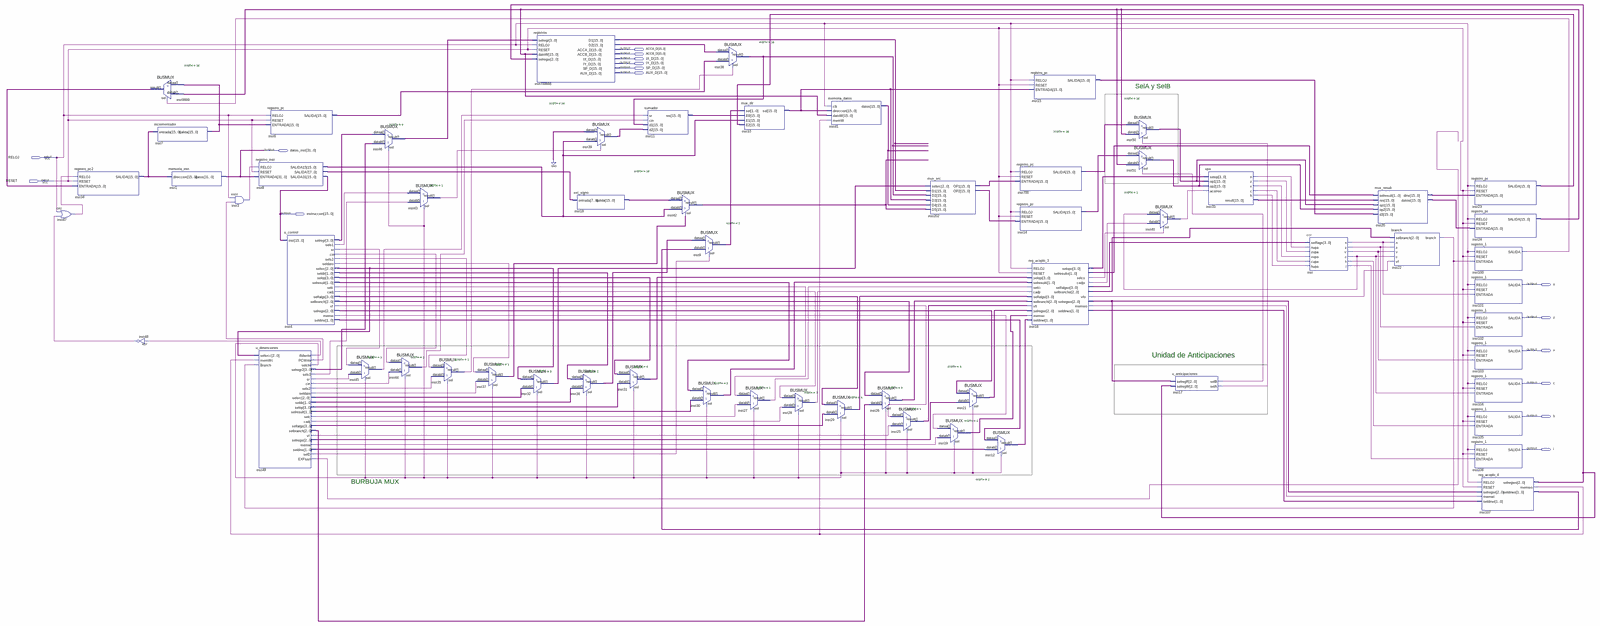
[diagram p0: schematic sheet, whole]
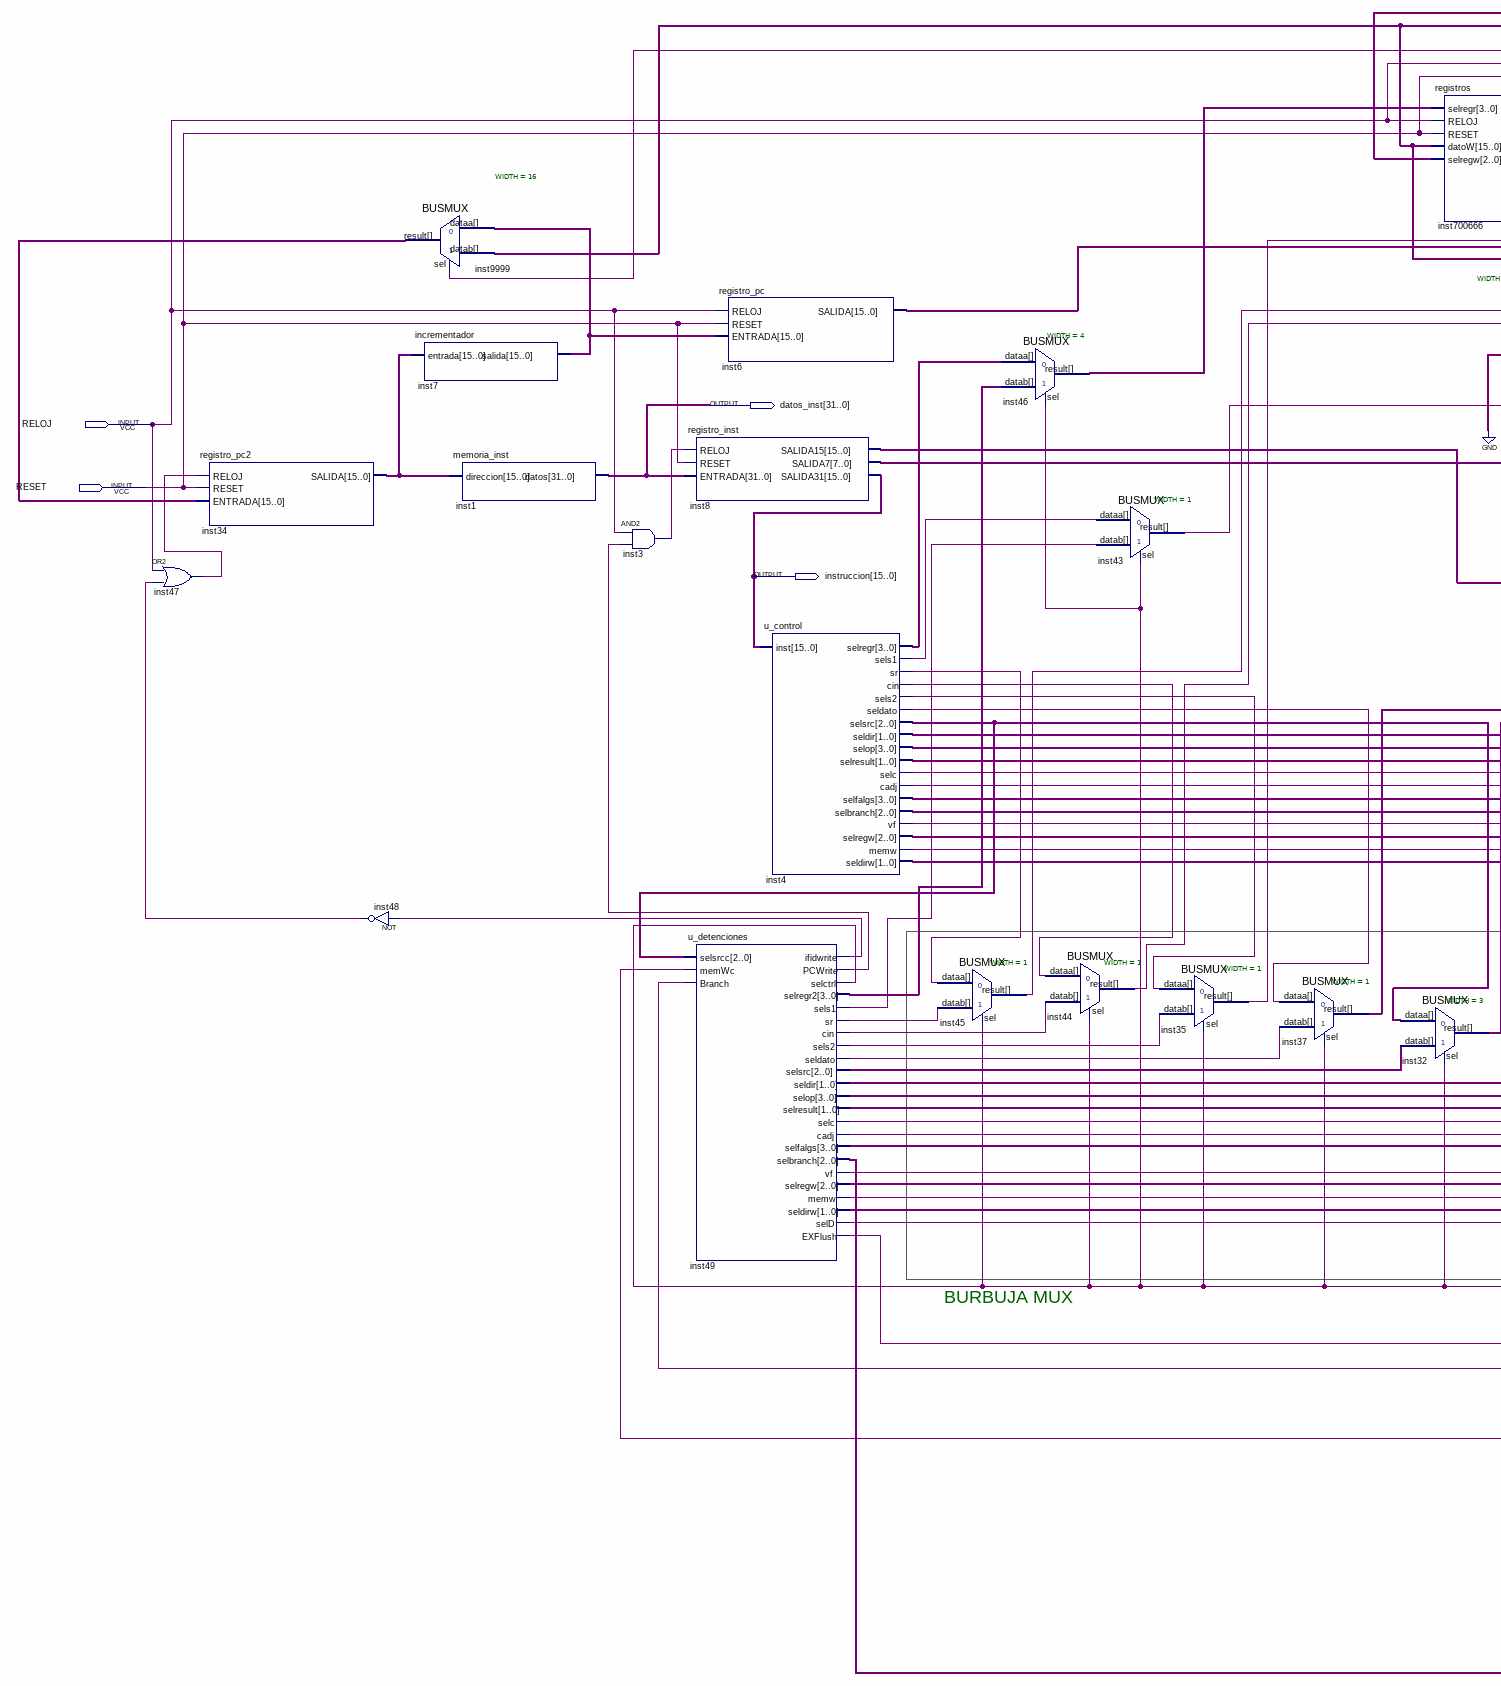
[diagram p1: schematic sheet, left part]
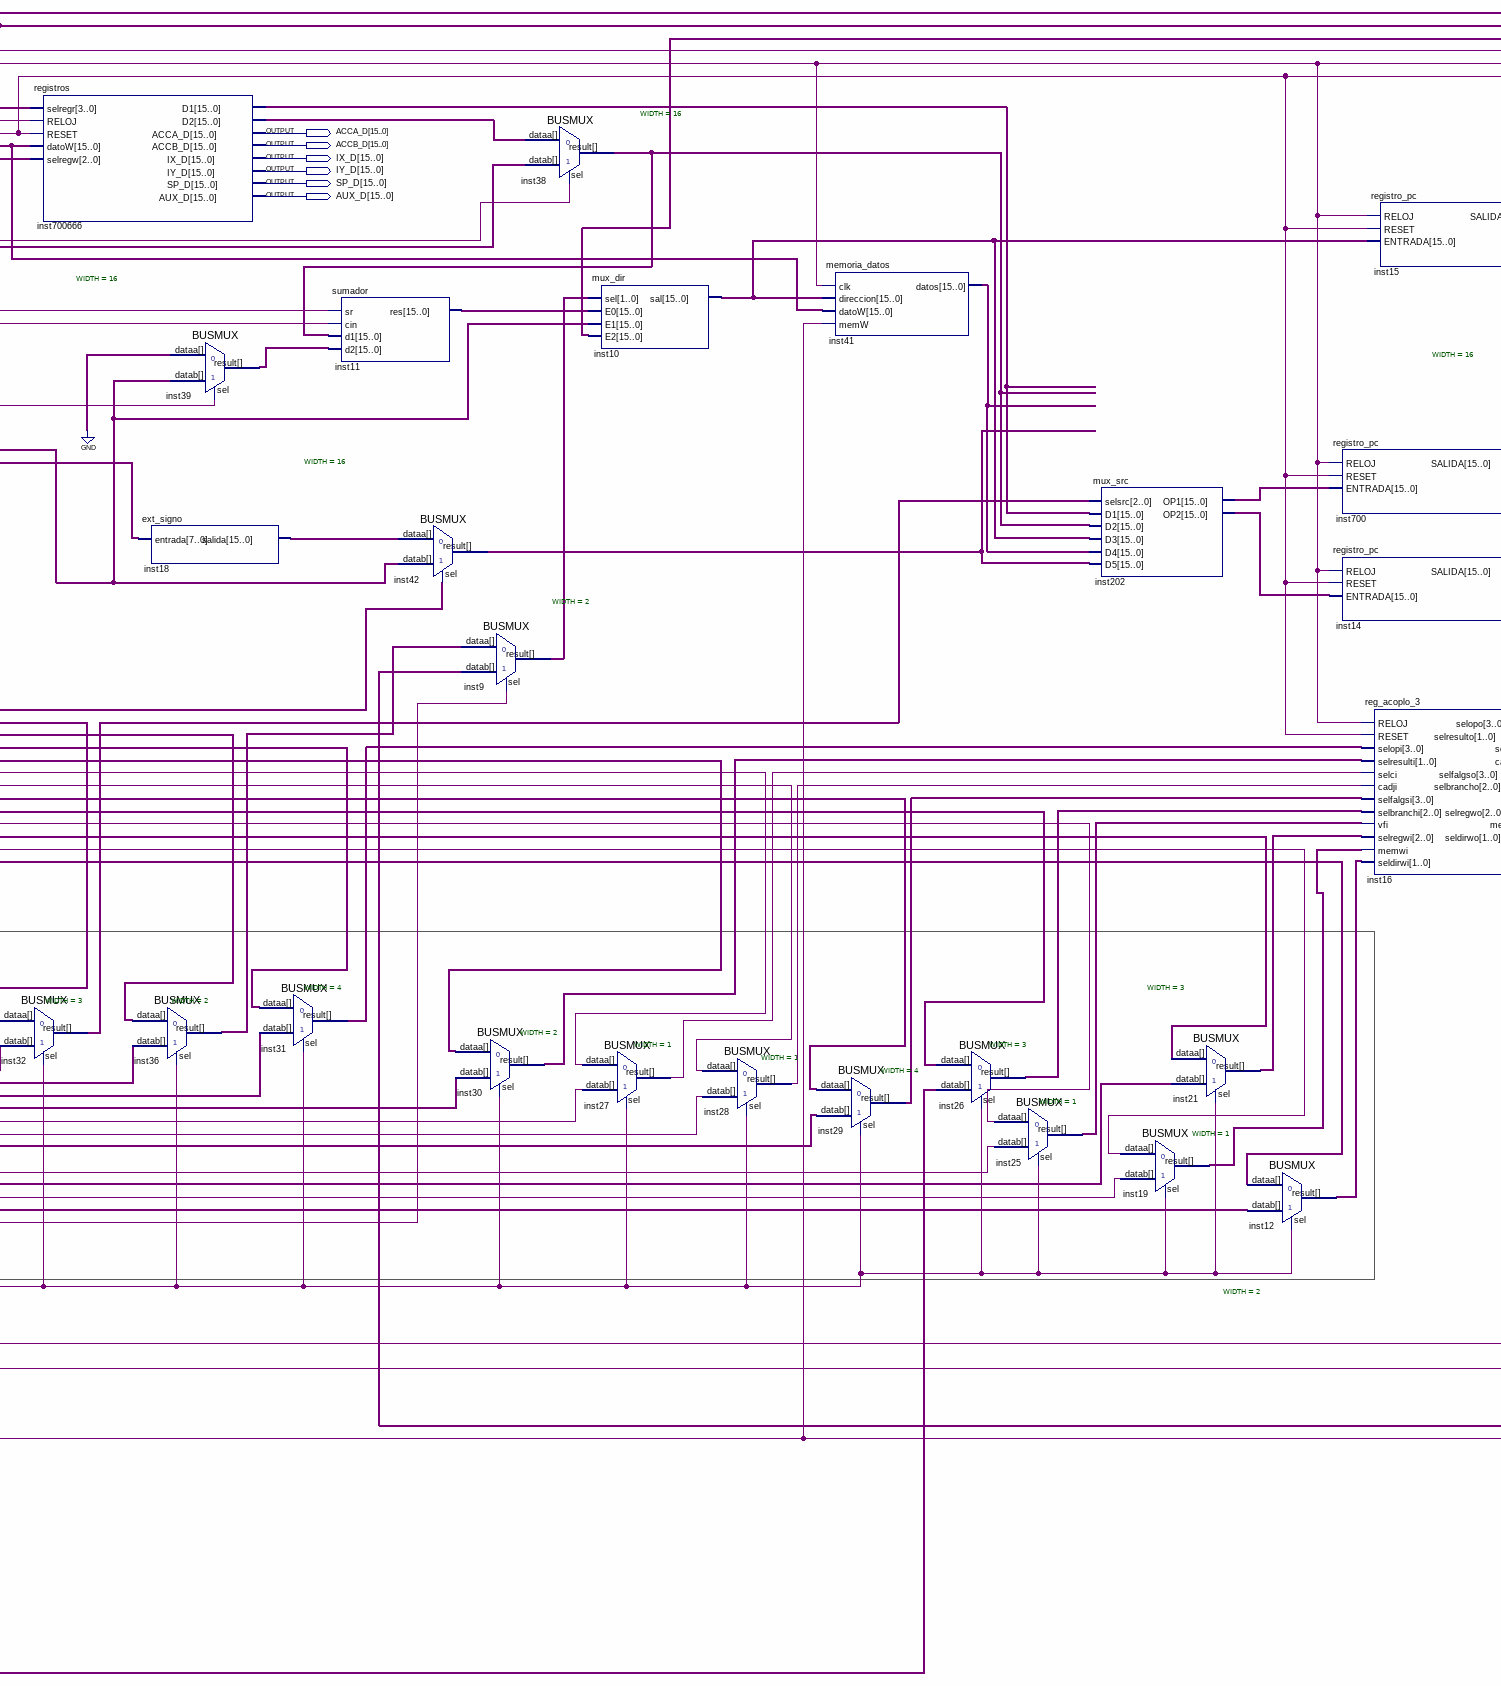
[diagram p2: schematic sheet, centre part]
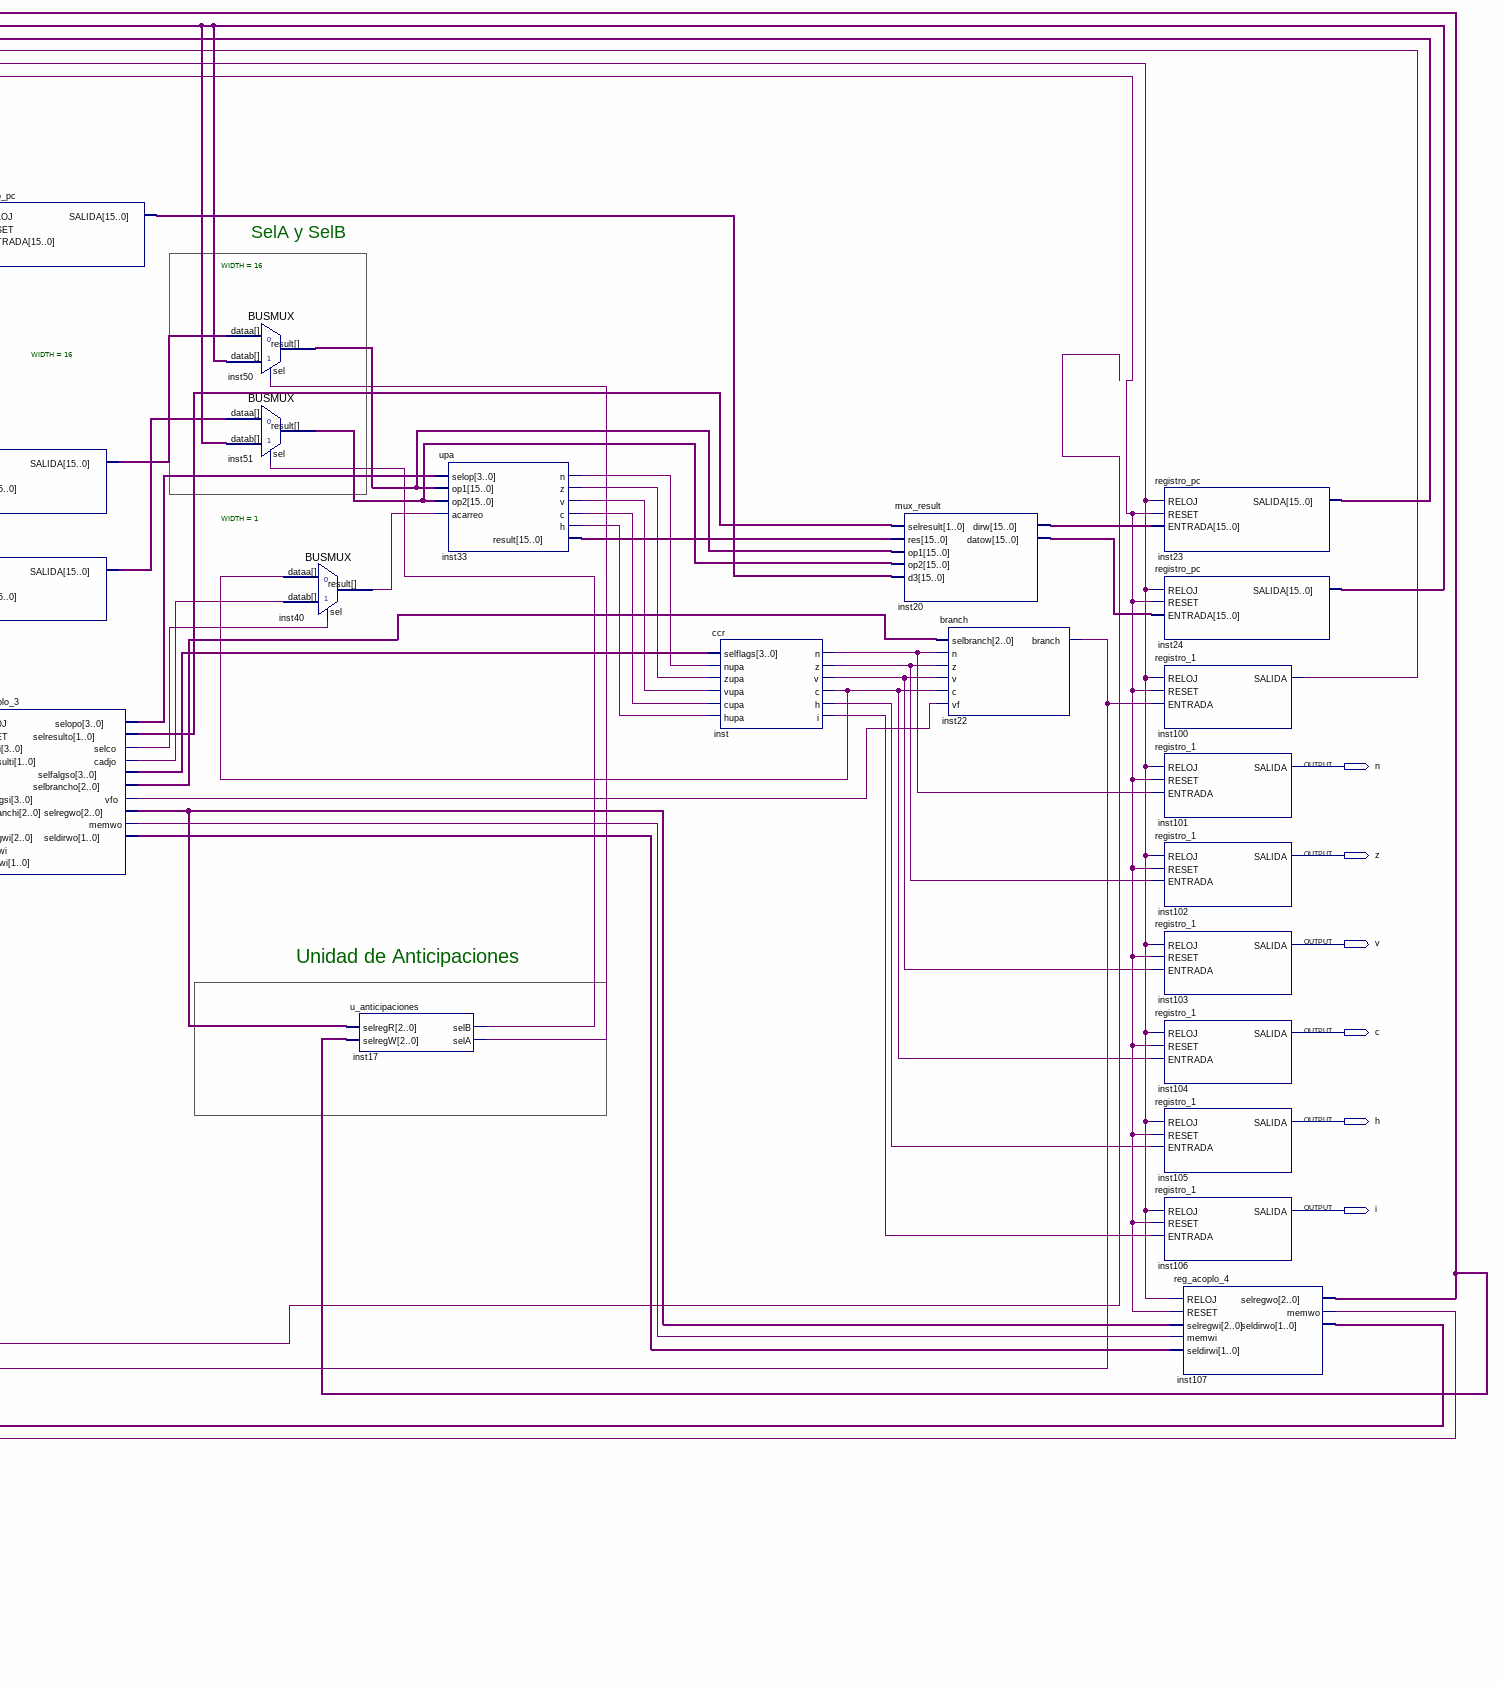
[diagram p3: schematic sheet, right part]
// Quartus schematic pipeline.bdf as structural Verilog: 61 symbols, 16 pins
module pipeline (
  input  RELOJ,
  input  RESET,
  output [15:0] ACCA_D,
  output [15:0] ACCB_D,
  output [15:0] IX_D,
  output [15:0] IY_D,
  output [15:0] SP_D,
  output [15:0] AUX_D,
  output [31:0] datos_inst,
  output [15:0] instruccion,
  output n,
  output z,
  output v,
  output c,
  output h,
  output i
);

  wire inst3_out, inst4_cadj, inst4_cin, inst4_memw, inst4_selc, inst4_seldato, inst4_sels1, inst4_sels2,
       inst4_sr, inst4_vf, inst16_cadjo, inst16_memwo, inst16_selco, inst16_vfo, inst17_sela, inst17_selb,
       inst19_result, inst22_branch, inst25_result, inst27_result, inst28_result, inst33_c, inst33_h,
       inst33_n, inst33_v, inst33_z, inst35_result, inst37_result, inst40_result, inst43_result,
       inst44_result, inst45_result, inst47_out, inst48_out, inst49_cadj, inst49_cin, inst49_exflush,
       inst49_ifidwrite, inst49_memw, inst49_pcwrite, inst49_selc, inst49_selctrl, inst49_seld,
       inst49_seldato, inst49_sels1, inst49_sels2, inst49_sr, inst49_vf, inst100_salida, inst107_memwo,
       inst_c, inst_h, inst_i, inst_n, inst_v, inst_z;
  wire [1:0] inst4_seldir, inst4_seldirw, inst4_selresult, inst9_result, inst12_result, inst16_seldirwo,
       inst16_selresulto, inst30_result, inst36_result, inst49_seldir, inst49_seldirw, inst49_selresult,
       inst107_seldirwo;
  wire [2:0] inst4_selbranch, inst4_selregw, inst4_selsrc, inst16_selbrancho, inst16_selregwo, inst21_result,
       inst26_result, inst32_result, inst49_selbranch, inst49_selregw, inst49_selsrc, inst107_selregwo;
  wire [3:0] inst4_selfalgs, inst4_selop, inst4_selregr, inst16_selfalgso, inst16_selopo, inst29_result,
       inst31_result, inst46_result, inst49_selfalgs, inst49_selop, inst49_selregr2;
  wire [7:0] inst8_salida7;
  wire [15:0] inst6_salida, inst7_salida, inst8_salida15, inst10_sal, inst11_res, inst14_salida,
       inst15_salida, inst18_salida, inst20_datow, inst20_dirw, inst23_salida, inst24_salida, inst33_result,
       inst34_salida, inst38_result, inst39_result, inst41_datos, inst42_result, inst50_result,
       inst51_result, inst202_op1, inst202_op2, inst700_salida, inst9999_result, inst700666_d1, inst700666_d2;

  registro_pc2 inst34 (.RELOJ(inst47_out), .RESET(RESET), .ENTRADA(inst9999_result), .SALIDA(inst34_salida));
  or inst47 (inst47_out, RELOJ, inst48_out);
  not inst48 (inst48_out, inst49_ifidwrite);
  BUSMUX #(.WIDTH(16)) inst9999 (
    .datab(inst24_salida), .sel(inst100_salida), .dataa(inst7_salida), .result(inst9999_result));
  incrementador inst7 (.entrada(inst34_salida), .salida(inst7_salida));
  memoria_inst inst1 (.direccion(inst34_salida), .datos(datos_inst));
  and inst3 (inst3_out, RELOJ, inst49_pcwrite);
  registro_inst inst8 (
    .RELOJ(inst3_out), .RESET(RESET), .ENTRADA(datos_inst), .SALIDA15(inst8_salida15),
    .SALIDA7(inst8_salida7), .SALIDA31(instruccion));
  u_detenciones inst49 (
    .selsrcc(inst4_selsrc), .memWc(inst107_memwo), .Branch(inst22_branch), .ifidwrite(inst49_ifidwrite),
    .PCWrite(inst49_pcwrite), .selctrl(inst49_selctrl), .selregr2(inst49_selregr2), .sels1(inst49_sels1),
    .sr(inst49_sr), .cin(inst49_cin), .sels2(inst49_sels2), .seldato(inst49_seldato), .selsrc(inst49_selsrc),
    .seldir(inst49_seldir), .selop(inst49_selop), .selresult(inst49_selresult), .selc(inst49_selc),
    .cadj(inst49_cadj), .selfalgs(inst49_selfalgs), .selbranch(inst49_selbranch), .vf(inst49_vf),
    .selregw(inst49_selregw), .memw(inst49_memw), .seldirw(inst49_seldirw), .selD(inst49_seld),
    .EXFlush(inst49_exflush));
  registro_pc inst6 (.RELOJ(RELOJ), .RESET(RESET), .ENTRADA(inst7_salida), .SALIDA(inst6_salida));
  u_control inst4 (
    .inst(instruccion), .selregr(inst4_selregr), .sels1(inst4_sels1), .sr(inst4_sr), .cin(inst4_cin),
    .sels2(inst4_sels2), .seldato(inst4_seldato), .selsrc(inst4_selsrc), .seldir(inst4_seldir),
    .selop(inst4_selop), .selresult(inst4_selresult), .selc(inst4_selc), .cadj(inst4_cadj),
    .selfalgs(inst4_selfalgs), .selbranch(inst4_selbranch), .vf(inst4_vf), .selregw(inst4_selregw),
    .memw(inst4_memw), .seldirw(inst4_seldirw));
  BUSMUX #(.WIDTH(1)) inst45 (.datab(inst49_sr), .sel(inst49_selctrl), .dataa(inst4_sr), .result(inst45_result));
  BUSMUX #(.WIDTH(4)) inst46 (
    .datab(inst49_selregr2), .sel(inst49_selctrl), .dataa(inst4_selregr), .result(inst46_result));
  BUSMUX #(.WIDTH(1)) inst44 (.datab(inst49_cin), .sel(inst49_selctrl), .dataa(inst4_cin), .result(inst44_result));
  BUSMUX #(.WIDTH(1)) inst43 (.datab(inst49_sels1), .sel(inst49_selctrl), .dataa(inst4_sels1), .result(inst43_result));
  BUSMUX #(.WIDTH(1)) inst35 (.datab(inst49_sels2), .sel(inst49_selctrl), .dataa(inst4_sels2), .result(inst35_result));
  BUSMUX #(.WIDTH(1)) inst37 (
    .datab(inst49_seldato), .sel(inst49_selctrl), .dataa(inst4_seldato), .result(inst37_result));
  BUSMUX #(.WIDTH(3)) inst32 (
    .datab(inst49_selsrc), .sel(inst49_selctrl), .dataa(inst4_selsrc), .result(inst32_result));
  registros inst700666 (
    .selregr(inst46_result), .RELOJ(RELOJ), .RESET(RESET), .datoW(inst24_salida), .selregw(inst107_selregwo),
    .D1(inst700666_d1), .D2(inst700666_d2), .ACCA_D(ACCA_D), .ACCB_D(ACCB_D), .IX_D(IX_D), .IY_D(IY_D),
    .SP_D(SP_D), .AUX_D(AUX_D));
  ext_signo inst18 (.entrada(inst8_salida7), .salida(inst18_salida));
  BUSMUX #(.WIDTH(2)) inst36 (
    .datab(inst49_seldir), .sel(inst49_selctrl), .dataa(inst4_seldir), .result(inst36_result));
  BUSMUX #(.WIDTH(16)) inst39 (.datab(inst8_salida15), .sel(inst43_result), .dataa({16{1'b0}}), .result(inst39_result));
  BUSMUX #(.WIDTH(4)) inst31 (.datab(inst49_selop), .sel(inst49_selctrl), .dataa(inst4_selop), .result(inst31_result));
  sumador inst11 (.sr(inst45_result), .cin(inst44_result), .d1(inst38_result), .d2(inst39_result), .res(inst11_res));
  BUSMUX #(.WIDTH(16)) inst42 (
    .datab(inst8_salida15), .sel(inst37_result), .dataa(inst18_salida), .result(inst42_result));
  BUSMUX #(.WIDTH(2)) inst9 (.datab(inst107_seldirwo), .sel(inst49_seld), .dataa(inst36_result), .result(inst9_result));
  BUSMUX #(.WIDTH(2)) inst30 (
    .datab(inst49_selresult), .sel(inst49_selctrl), .dataa(inst4_selresult), .result(inst30_result));
  BUSMUX #(.WIDTH(16)) inst38 (
    .datab(inst6_salida), .sel(inst35_result), .dataa(inst700666_d2), .result(inst38_result));
  mux_dir inst10 (.sel(inst9_result), .E0(inst11_res), .E1(inst8_salida15), .E2(inst23_salida), .sal(inst10_sal));
  BUSMUX #(.WIDTH(1)) inst27 (.datab(inst49_selc), .sel(inst49_selctrl), .dataa(inst4_selc), .result(inst27_result));
  BUSMUX #(.WIDTH(1)) inst28 (.datab(inst49_cadj), .sel(inst49_selctrl), .dataa(inst4_cadj), .result(inst28_result));
  memoria_datos inst41 (
    .clk(RELOJ), .direccion(inst10_sal), .datoW(inst24_salida), .memW(inst107_memwo), .datos(inst41_datos));
  BUSMUX #(.WIDTH(4)) inst29 (
    .datab(inst49_selfalgs), .sel(inst49_selctrl), .dataa(inst4_selfalgs), .result(inst29_result));
  BUSMUX #(.WIDTH(3)) inst26 (
    .datab(inst49_selbranch), .sel(inst49_selctrl), .dataa(inst4_selbranch), .result(inst26_result));
  BUSMUX #(.WIDTH(1)) inst25 (.datab(inst49_vf), .sel(inst49_selctrl), .dataa(inst4_vf), .result(inst25_result));
  mux_src inst202 (
    .selsrc(inst32_result), .D1(inst700666_d1), .D2(inst38_result), .D3(inst10_sal), .D4(inst41_datos),
    .D5(inst42_result), .OP1(inst202_op1), .OP2(inst202_op2));
  BUSMUX #(.WIDTH(1)) inst19 (.datab(inst49_memw), .sel(inst49_selctrl), .dataa(inst4_memw), .result(inst19_result));
  BUSMUX #(.WIDTH(3)) inst21 (
    .datab(inst49_selregw), .sel(inst49_selctrl), .dataa(inst4_selregw), .result(inst21_result));
  BUSMUX #(.WIDTH(2)) inst12 (
    .datab(inst49_seldirw), .sel(inst49_selctrl), .dataa(inst4_seldirw), .result(inst12_result));
  registro_pc inst700 (.RELOJ(RELOJ), .RESET(RESET), .ENTRADA(inst202_op1), .SALIDA(inst700_salida));
  registro_pc inst14 (.RELOJ(RELOJ), .RESET(RESET), .ENTRADA(inst202_op2), .SALIDA(inst14_salida));
  registro_pc inst15 (.RELOJ(RELOJ), .RESET(RESET), .ENTRADA(inst10_sal), .SALIDA(inst15_salida));
  reg_acoplo_3 inst16 (
    .RELOJ(RELOJ), .RESET(RESET), .selopi(inst31_result), .selresulti(inst30_result), .selci(inst27_result),
    .cadji(inst28_result), .selfalgsi(inst29_result), .selbranchi(inst26_result), .vfi(inst25_result),
    .selregwi(inst21_result), .memwi(inst19_result), .seldirwi(inst12_result), .selopo(inst16_selopo),
    .selresulto(inst16_selresulto), .selco(inst16_selco), .cadjo(inst16_cadjo), .selfalgso(inst16_selfalgso),
    .selbrancho(inst16_selbrancho), .vfo(inst16_vfo), .selregwo(inst16_selregwo), .memwo(inst16_memwo),
    .seldirwo(inst16_seldirwo));
  BUSMUX #(.WIDTH(16)) inst50 (
    .datab(inst24_salida), .sel(inst17_sela), .dataa(inst700_salida), .result(inst50_result));
  BUSMUX #(.WIDTH(16)) inst51 (.datab(inst24_salida), .sel(inst17_selb), .dataa(inst14_salida), .result(inst51_result));
  BUSMUX #(.WIDTH(1)) inst40 (.datab(inst16_cadjo), .sel(inst16_selco), .dataa(inst_c), .result(inst40_result));
  u_anticipaciones inst17 (
    .selregR(inst16_selregwo), .selregW(inst107_selregwo), .selB(inst17_selb), .selA(inst17_sela));
  upa inst33 (
    .selop(inst16_selopo), .op1(inst50_result), .op2(inst51_result), .acarreo(inst40_result), .n(inst33_n),
    .z(inst33_z), .v(inst33_v), .c(inst33_c), .h(inst33_h), .result(inst33_result));
  ccr inst (
    .selflags(inst16_selfalgso), .nupa(inst33_n), .zupa(inst33_z), .vupa(inst33_v), .cupa(inst33_c),
    .hupa(inst33_h), .n(inst_n), .z(inst_z), .v(inst_v), .c(inst_c), .h(inst_h), .i(inst_i));
  mux_result inst20 (
    .selresult(inst16_selresulto), .res(inst33_result), .op1(inst50_result), .op2(inst51_result),
    .d3(inst15_salida), .dirw(inst20_dirw), .datow(inst20_datow));
  branch inst22 (
    .selbranch(inst16_selbrancho), .n(inst_n), .z(inst_z), .v(inst_v), .c(inst_c), .vf(inst16_vfo),
    .branch(inst22_branch));
  registro_pc inst23 (.RELOJ(RELOJ), .RESET(RESET), .ENTRADA(inst20_dirw), .SALIDA(inst23_salida));
  registro_pc inst24 (.RELOJ(RELOJ), .RESET(RESET), .ENTRADA(inst20_datow), .SALIDA(inst24_salida));
  registro_1 inst100 (.RELOJ(RELOJ), .RESET(RESET), .ENTRADA(inst22_branch), .SALIDA(inst100_salida));
  registro_1 inst101 (.RELOJ(RELOJ), .RESET(RESET), .ENTRADA(inst_n), .SALIDA(n));
  registro_1 inst102 (.RELOJ(RELOJ), .RESET(RESET), .ENTRADA(inst_z), .SALIDA(z));
  registro_1 inst103 (.RELOJ(RELOJ), .RESET(RESET), .ENTRADA(inst_v), .SALIDA(v));
  registro_1 inst104 (.RELOJ(RELOJ), .RESET(RESET), .ENTRADA(inst_c), .SALIDA(c));
  registro_1 inst105 (.RELOJ(RELOJ), .RESET(RESET), .ENTRADA(inst_h), .SALIDA(h));
  registro_1 inst106 (.RELOJ(RELOJ), .RESET(RESET), .ENTRADA(inst_i), .SALIDA(i));
  reg_acoplo_4 inst107 (
    .RELOJ(RELOJ), .RESET(RESET), .selregwi(inst16_selregwo), .memwi(inst16_memwo),
    .seldirwi(inst16_seldirwo), .selregwo(inst107_selregwo), .memwo(inst107_memwo),
    .seldirwo(inst107_seldirwo));

  // Notes on the sheet:
  //   SelA y SelB
  //   Unidad de Anticipaciones
  //   BURBUJA MUX
endmodule
